# Altium schematic sheet Current limiter.SchDoc
size A4
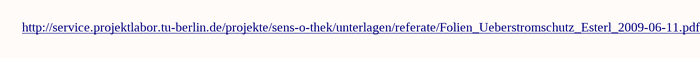
[diagram p0: Current limiter.SchDoc]

## Notes on the sheet
- http://service.projektlabor.tu-berlin.de/projekte/sens-o-thek/unterlagen/referate/Folien_Ueberstromschutz_Esterl_2009-06-11.pdf